# Altium schematic sheet Peripherals.SchDoc
size A; SheetNumber: 4; SheetTotal: 5
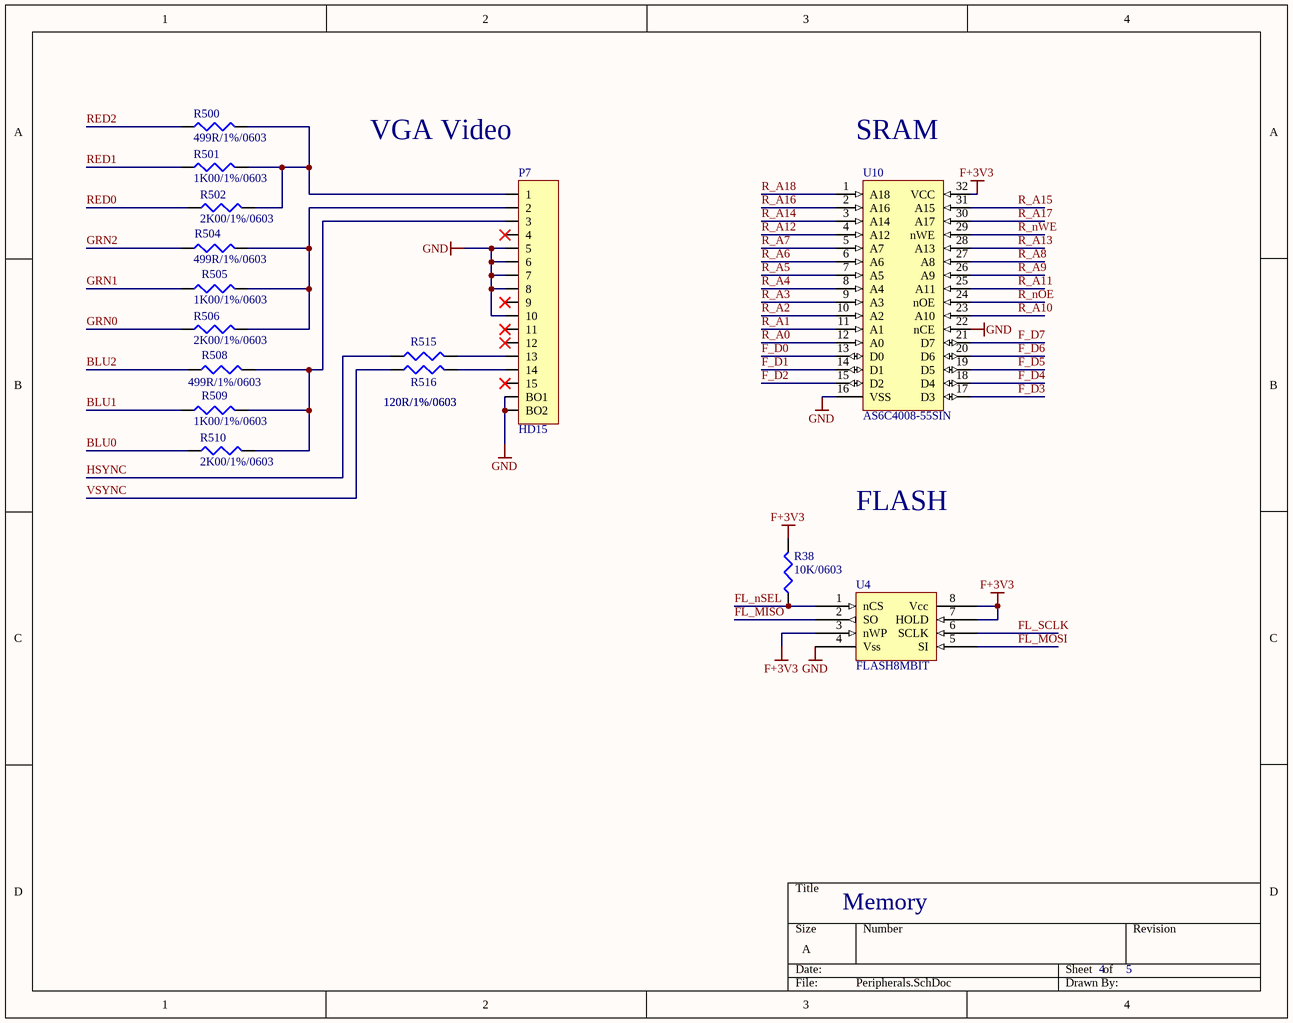
[diagram p0: Peripherals.SchDoc]

## Parts
P7  HD15  [DB15FLC]
R38  10K/0603  [0603]
R500  499R/1%/0603  [0603]
R501  1K00/1%/0603  [0603]
R502  2K00/1%/0603  [0603]
R504  499R/1%/0603  [0603]
R505  1K00/1%/0603  [0603]
R506  2K00/1%/0603  [0603]
R508  499R/1%/0603  [0603]
R509  1K00/1%/0603  [0603]
R510  2K00/1%/0603  [0603]
R515  120R/1%/0603  [0603]
R516  120R/1%/0603  [0603]
U4  FLASH8MBIT  [SO-8WM]
U10  AS6C4008-55SIN  [SOP32W]

## Nets
F+3V3: R38.2 U4.3(nWP) U4.7(HOLD) U4.8(Vcc) U10.32(VCC)
GND: P7.5 P7.6 P7.7 P7.8 P7.10 P7.BO1 P7.BO2 U4.4(Vss) U10.16(VSS) U10.22(nCE)
BLU0: R510.1
BLU1: R509.1
BLU2: R508.1
F_D0: U10.13(D0)
F_D1: U10.14(D1)
F_D2: U10.15(D2)
F_D3: U10.17(D3)
F_D4: U10.18(D4)
F_D5: U10.19(D5)
F_D6: U10.20(D6)
F_D7: U10.21(D7)
FL_MISO: U4.2(SO)
FL_MOSI: U4.5(SI)
FL_nSEL: R38.1 U4.1(nCS)
FL_SCLK: U4.6(SCLK)
GRN0: R506.1
GRN1: R505.1
GRN2: R504.1
HSYNC: R515.1
R_A0: U10.12(A0)
R_A1: U10.11(A1)
R_A2: U10.10(A2)
R_A3: U10.9(A3)
R_A4: U10.8(A4)
R_A5: U10.7(A5)
R_A6: U10.6(A6)
R_A7: U10.5(A7)
R_A8: U10.27(A8)
R_A9: U10.26(A9)
R_A10: U10.23(A10)
R_A11: U10.25(A11)
R_A12: U10.4(A12)
R_A13: U10.28(A13)
R_A14: U10.3(A14)
R_A15: U10.31(A15)
R_A16: U10.2(A16)
R_A17: U10.30(A17)
R_A18: U10.1(A18)
R_nOE: U10.24(nOE)
R_nWE: U10.29(nWE)
RED0: R502.1
RED1: R501.1
RED2: R500.1
VSYNC: R516.1
NetP7_1: P7.1 R500.2 R501.2 R502.2
NetP7_2: P7.2 R504.2 R505.2 R506.2
NetP7_3: P7.3 R508.2 R509.2 R510.2
NetP7_13: P7.13 R515.2
NetP7_14: P7.14 R516.2

Not connected (* = marked no-connect by the designer): P7 4* 9* 11* 12* 15*

## Notes on the sheet
- (near P7) VGA Video
- (near U10) SRAM
- FLASH
- Memory

## Library data of the parts
P7 = HD15: CONN DSUB HD RCPT 15POS R/A SLDR; Text Field1: Amphenol; Mfg PN: ICD15S13E4GX00LF; DK PN: 609-5181-ND
R38 = 10K/0603: RES 10.0K OHM 1/10W 1% 0603 SMD; MFG: Dale/Vishay; MFG PN: CRCW060310K0FKEA; DK PN: 541-10.0KHCT-ND; Price: 5.02
R500 R504 R508 = 499R/1%/0603: 499 Ohms ±1% 0.1W, 1/10W Chip Resistor 0603 (1608 Metric) Moisture Resistant Thick Film; MFG: Yeago; MFG PN: RC0603FR-07499RL; DK PN: 311-499HRCT-ND
R501 R505 R509 = 1K00/1%/0603: 1 kOhms ±1% 0.1W, 1/10W Chip Resistor 0603 (1608 Metric) Moisture Resistant Thick Film; MFG: Yeago; MFG PN: RC0603FR-071KL; DK PN: 311-1.00KHRCT-ND
R502 R506 R510 = 2K00/1%/0603: 2 kOhms ±1% 0.1W, 1/10W Chip Resistor 0603 (1608 Metric) Moisture Resistant Thick Film; MFG: Yeago; MFG PN: RC0603FR-072KL; DK PN: 311-2.00KHRCT-ND
R515 R516 = 120R/1%/0603: 120 Ohms ±1% 0.1W, 1/10W Chip Resistor 0603 (1608 Metric) Moisture Resistant Thick Film; MFG: Yaego; MFG PN: RC0603FR-07120RL; DK PN: 311-120HRCT-ND
U4 = FLASH8MBIT: IC FLASH 8MBIT SPI/QUAD 8SOIC; MFG: Cyoress; DK PN: 1265-AT25SF081B-SSHD-B-ND; MFG PN: AT25SF081B-SSHD-B
U10 = AS6C4008-55SIN: SRAM - Asynchronous Memory IC 4Mb (512K x 8) Parallel 55 ns 32-SOP; MFG: Alliance Memory, Inc.; DK PN: 1450-1028-ND; MFG PN: AS6C4008-55SIN; Price: 1.17